# Altium project Servo-Board-v1.0.PrjPcb (part 16 of 19)

## Sheet Motor_Driver_Sheet4.SchDoc
size 420 x 297 mm; SheetNumber: 29; SheetTotal: 32
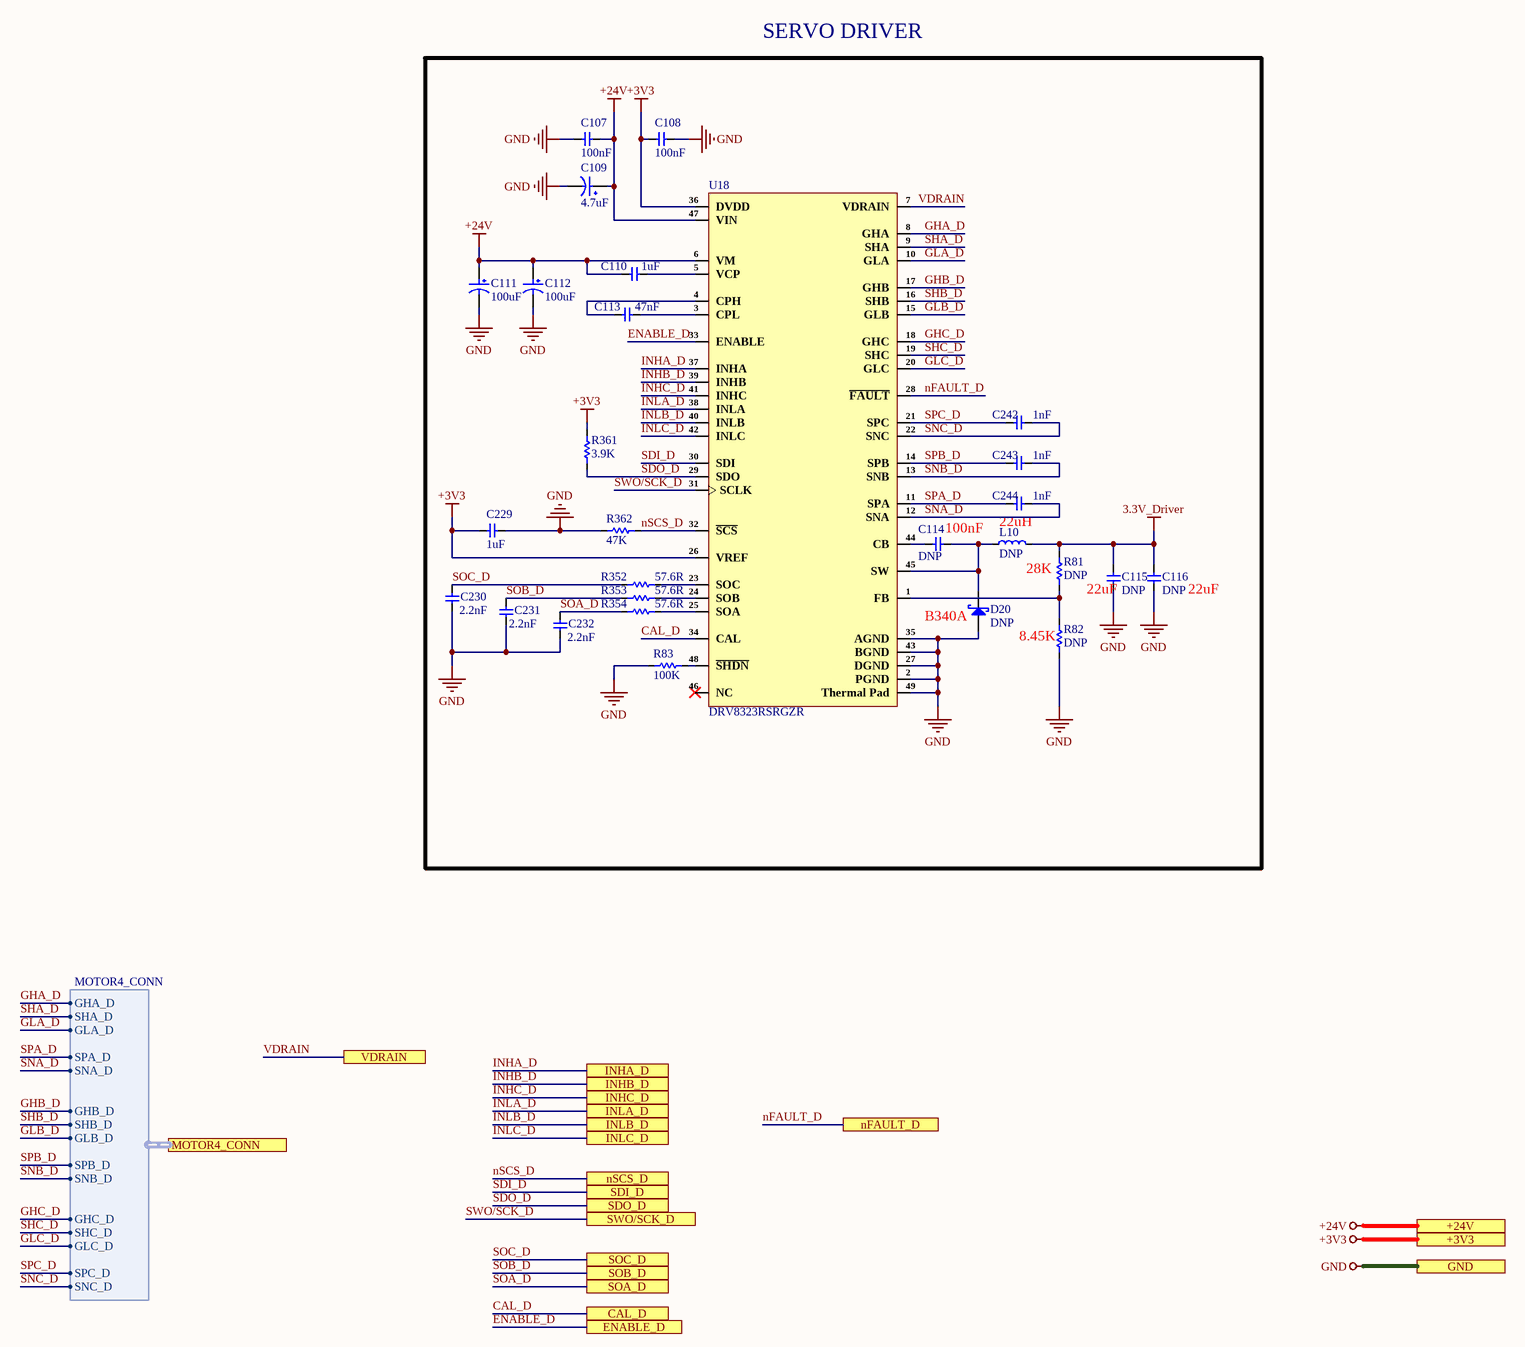
[diagram p28: Motor_Driver_Sheet4.SchDoc]

### Parts
C107  100nF  [cap-0402]
C108  100nF  [cap-0402]
C109  4.7uF  [VT1H4R7M0405]
C110  1uF  [Cap-0402]
C111  100uF  [RVT1A101M0605]
C112  100uF  [RVT1A101M0605]
C113  47nF  [Cap-0402]
C114  DNP  [cap-0402]
C115  DNP  [Cap-0805]
C116  DNP  [Cap-0805]
C229  1uF  [Cap-0402]
C230  2.2nF  [Cap-0603]
C231  2.2nF  [Cap-0603]
C232  2.2nF  [Cap-0603]
C242  1nF  [Cap-0402]
C243  1nF  [Cap-0402]
C244  1nF  [Cap-0402]
D20  DNP  [SMA(DO-214AC)]
L10  DNP  [SLF7045T- 220MR90-PF]
R81  DNP  [Res-0402]
R82  DNP  [Res-0402]
R83  100K  [Res-0402]
R352  57.6R  [Res-0402]
R353  57.6R  [Res-0402]
R354  57.6R  [Res-0402]
R361  3.9K  [Res-0402]
R362  47K  [Res-0402]
U18  DRV8323RSRGZR  [48-VQFN (7x7)]

### Ports
+3V3 (see Servo4[3A], CAN_Sheet[5D], Connector_Sheet[5D], Controller_Sheet[5D], Encoder_Sheet1[5D], Encoder_Sheet2[5D], Encoder_Sheet3[5D], Encoder_Sheet4[5D], EtherCAT_Sheet[5D], Motor_Driver_Sheet1[5D], Motor_Driver_Sheet2[5D], Motor_Driver_Sheet3[5D], Power_Sheet[5D], RJ45_Sheet[5D], RS485_RS232_Sheet[3D], Sec_Controller_Sheet1[5D], Sec_Controller_Sheet2[5D], Sec_Controller_Sheet3[5D], Sec_Controller_Sheet4[5D]), +24V (see Servo4[3A], Connector_Sheet[5D], DIO_1[5D], DIO_2[5D], DIO_3[5D], DIO_4[5D], MOSFET_Driver_Sheet1[5D], MOSFET_Driver_Sheet2[5D], MOSFET_Driver_Sheet3[5D], MOSFET_Driver_Sheet4[5D], Motor_Driver_Sheet1[5D], Motor_Driver_Sheet2[5D], Motor_Driver_Sheet3[5D], Power_Sheet[5D]), CAL_D (see Servo4[3B], Sec_Controller_Sheet4[2D]), ENABLE_D (see Servo4[3B], Sec_Controller_Sheet4[2D]), GND (see Servo4[3B], CAN_Sheet[5D], Connector_Sheet[5D], Controller_Sheet[5D], DIO_1[5D], DIO_2[5D], DIO_3[5D], DIO_4[5D], Encoder_Sheet1[5D], Encoder_Sheet2[5D], Encoder_Sheet3[5D], Encoder_Sheet4[5D], EtherCAT_Sheet[5D], MOSFET_Driver_Sheet1[5D], MOSFET_Driver_Sheet2[5D], MOSFET_Driver_Sheet3[5D], MOSFET_Driver_Sheet4[5D], Motor_Driver_Sheet1[5D], Motor_Driver_Sheet2[5D], Motor_Driver_Sheet3[5D], Power_Sheet[5D], RJ45_Sheet[5D], RS485_RS232_Sheet[3D], Sec_Controller_Sheet1[5D], Sec_Controller_Sheet2[5D], Sec_Controller_Sheet3[5D], Sec_Controller_Sheet4[5D]), INHA_D (see Servo4[3B], Sec_Controller_Sheet4[2D]), INHB_D (see Servo4[3B], Sec_Controller_Sheet4[2D]), INHC_D (see Servo4[3B], Sec_Controller_Sheet4[2D]), INLA_D (see Servo4[3B], Sec_Controller_Sheet4[2D]), INLB_D (see Servo4[3B], Sec_Controller_Sheet4[2D]), INLC_D (see Servo4[3B], Sec_Controller_Sheet4[2D]), MOTOR4_CONN (harness MOTOR4_CONN, see Servo4[4B], MOSFET_Driver_Sheet4[2D]), nFAULT_D (see Servo4[3B], Sec_Controller_Sheet4[3D]), nSCS_D (see Servo4[3B], Sec_Controller_Sheet4[2D]), SDI_D (see Servo4[3B], Sec_Controller_Sheet4[2D]), SDO_D (see Servo4[3B], Sec_Controller_Sheet4[2D]), SOA_D (see Servo4[3B], Sec_Controller_Sheet4[2D]), SOB_D (see Servo4[3B], Sec_Controller_Sheet4[2D]), SOC_D (see Servo4[3B], Sec_Controller_Sheet4[2D]), SWO/SCK_D (see Servo4[3B], Sec_Controller_Sheet4[2D]), VDRAIN (see Servo4[4B], MOSFET_Driver_Sheet1[2D], MOSFET_Driver_Sheet2[2D], MOSFET_Driver_Sheet3[2D], MOSFET_Driver_Sheet4[2D], Motor_Driver_Sheet1[2D], Motor_Driver_Sheet2[2D], Motor_Driver_Sheet3[2D])

### Harnesses
MOTOR4_CONN: GHA_D, SHA_D, GLA_D, SPA_D, SNA_D, GHB_D, SHB_D, GLB_D, SPB_D, SNB_D, GHC_D, SHC_D, GLC_D, SPC_D, SNC_D

### Nets
3.3V_Driver: C115.2 C116.2 L10.2 R81.2
+3V3: C108.2 C229.1 R361.2 U18.26(VREF) U18.36(DVDD) ; port +3V3
GND: C107.2 C108.1 C109.2 C111.2 C112.2 C115.1 C116.1 C229.2 C230.1 C231.1 C232.1 D20.2(A) R82.1 R83.1 R362.1 U18.2(PGND) U18.27(DGND) U18.35(AGND) U18.43(BGND) U18.49(Thermal_Pad) ; port GND
VDRAIN: C107.1 C109.1 C110.2 C111.1 C112.1 U18.6(VM) U18.7(VDRAIN) U18.47(VIN) ; port +24V, port VDRAIN  [also labelled +24V]
CAL_D: U18.34(CAL) ; port CAL_D
ENABLE_D: U18.33(ENABLE) ; port ENABLE_D
GHA_D: U18.8(GHA) ; port MOTOR4_CONN.GHA_D
GHB_D: U18.17(GHB) ; port MOTOR4_CONN.GHB_D
GHC_D: U18.18(GHC) ; port MOTOR4_CONN.GHC_D
GLA_D: U18.10(GLA) ; port MOTOR4_CONN.GLA_D
GLB_D: U18.15(GLB) ; port MOTOR4_CONN.GLB_D
GLC_D: U18.20(GLC) ; port MOTOR4_CONN.GLC_D
INHA_D: U18.37(INHA) ; port INHA_D
INHB_D: U18.39(INHB) ; port INHB_D
INHC_D: U18.41(INHC) ; port INHC_D
INLA_D: U18.38(INLA) ; port INLA_D
INLB_D: U18.40(INLB) ; port INLB_D
INLC_D: U18.42(INLC) ; port INLC_D
nFAULT_D: U18.28(~{FAULT}) ; port nFAULT_D
nSCS_D: R362.2 U18.32(~{SCS}) ; port nSCS_D
SDI_D: U18.30(SDI) ; port SDI_D
SDO_D: R361.1 U18.29(SDO) ; port SDO_D
SHA_D: U18.9(SHA) ; port MOTOR4_CONN.SHA_D
SHB_D: U18.16(SHB) ; port MOTOR4_CONN.SHB_D
SHC_D: U18.19(SHC) ; port MOTOR4_CONN.SHC_D
SNA_D: C244.1 U18.12(SNA) ; port MOTOR4_CONN.SNA_D
SNB_D: C243.1 U18.13(SNB) ; port MOTOR4_CONN.SNB_D
SNC_D: C242.1 U18.22(SNC) ; port MOTOR4_CONN.SNC_D
SOA_D: C232.2 R354.1 ; port SOA_D
SOB_D: C231.2 R353.1 ; port SOB_D
SOC_D: C230.2 R352.1 ; port SOC_D
SPA_D: C244.2 U18.11(SPA) ; port MOTOR4_CONN.SPA_D
SPB_D: C243.2 U18.14(SPB) ; port MOTOR4_CONN.SPB_D
SPC_D: C242.2 U18.21(SPC) ; port MOTOR4_CONN.SPC_D
SWO/SCK_D: U18.31(SCLK) ; port SWO/SCK_D
NetC110_1: C110.1 U18.5(VCP)
NetC113_1: C113.1 U18.4(CPH)
NetC113_2: C113.2 U18.3(CPL)
NetC114_1: C114.1 D20.1(K) L10.1 U18.45(SW)
NetC114_2: C114.2 U18.44(CB)
NetR81_1: R81.1 R82.2 U18.1(FB)
NetR83_2: R83.2 U18.48(~{SHDN})
NetR352_2: R352.2 U18.23(SOC)
NetR353_2: R353.2 U18.24(SOB)
NetR354_2: R354.2 U18.25(SOA)

Not connected (* = marked no-connect by the designer): U18 46(NC)*

### Notes on the sheet
- SERVO DRIVER
- (near C114) 100nF
- 22uH
- B340A
- 28K
- (near C115) 22uF
- (near C116) 22uF
- (near R82) 8.45K
- File:
- Title:
- Date:
- Page
- Num:
- Total:
- Drawn By: Huzaifa Ali

### Library data of the parts
C107 C108 C114 = C1005X7R1H104KT000F: as C59-C62 on sheet Sec_Controller_Sheet3; Supplier 1: Avnet; Manufacturer Part Number: C1005X7R1H104KT000F; RoHS: No; Category: Ceramic Capacitors; Dielectric: X7R; Supplier Part Number 1: C1005X7R1H104KT000F; LCSC Part Number: C361198; ComponentLink1Description: LCSC; ComponentLink1URL: https://www.lcsc.com/product-detail/Multilayer-Ceramic-Capacitors-MLCC-SMD-SMT_TDK-C1005X7R1H104KT000F_C361198.html
C109 = VT1H4R7M0405: 4.7uF 50V 14mA@120Hz ±20% SMD,D4xL5.4mm Aluminum Electrolytic Capacitors - SMD ROHS; Manufacturer: Roqang; Supplier: LCSC; LCSC Part Number: C213488; Manufacturer Part Number: VT1H4R7M0405; RoHS: No; Item Type: Capacitor
C110 C229 = CC0402KRX5R6BB105: as C212 on sheet Sec_Controller_Sheet3; Supplier 1: Mouser; Manufacturer Part Number: CC0402KRX5R6BB105; RoHS: Yes; Category: Ceramic Capacitors; Stock 1: 6711367; Pricing 1: 1=0.11000, 10=0.05500, 50=0.05500, 100=0.03300, 500=0.02700, 1000=0.02200, 2500=0.02100, 10000=0.01800 (USD); Mount: Surface Mount; Case/Package: 0402; Number of Pins: 2; Case Code (Metric): 1005; Case Code (Imperial): 0402; Min Operating Temperature: -55°C; Max Operating Temperature: 85°C; Capacitance: 1uF; Dielectric: X5R; Package Quantity: 1; Voltage Rating: 10V; Packaging: Tape and Reel; Voltage Rating (DC): 10V; Termination: SMD/SMT; Resistor Type: Ceramic; Series: CC; Construction: Flat; Length: 1mm; Width: 0.02inch; Height: 0.5mm; Thickness: 0.022inch; Depth: 0.5mm; Radiation Hardening: No; REACH SVHC: No SVHC; Lead Free: Lead Free; Halogen Free: Halogen Free; RoHS Compliant: Yes; ComponentLink1URL: https://datasheet.ciiva.com/176/upy-gphc-x5r-4v-to-50v-12-176704.pdf?src-supplier=Digi-Key; ComponentLink1Description: https://datasheet.ciiva.com/176/upy-gphc-x5r-4v-to-50v-12-176704.pdf?src-supplier=Digi-Key; ComponentLink2URL: https://datasheet.ciiva.com/176/mlccorderingcode-176705.pdf?src-supplier=Digi-Key; ComponentLink2Description: https://datasheet.ciiva.com/176/mlccorderingcode-176705.pdf?src-supplier=Digi-Key; ComponentLink3URL: https://datasheet.ciiva.com/176/mlccorderingcode-176706.pdf?src-supplier=Digi-Key; ComponentLink3Description: https://datasheet.ciiva.com/176/mlccorderingcode-176706.pdf?src-supplier=Digi-Key; Supplier Part Number 1: 603-CC402KRX5R6BB105; LCSC Part Number: C106254
C111 C112 = RVT1A101M0605: as C136 on sheet MOSFET_Driver_Sheet4; Manufacturer Part Number: RVT1A101M0605; Package: SMD,D6.3xL5.4mm; LCSC Part Number: C72474; Item Type: Capacitor; ComponentLink1Description: LCSC; ComponentLink1URL: https://www.lcsc.com/product-detail/Aluminum-Electrolytic-Capacitors-SMD_ROQANG-RVT1A101M0605_C72474.html
C113 = CC0402KRX7R9BB473: CAP CER 0.047UF 50V X7R 0402; Manufacturer: Yageo; Material: 4241ConductorMaterial; Tolerance: 10%; Temperature Coefficient: 30ppm/°C; Dielectric: 1511DielectricType; Item Type: Capacitor; Supplier: Future Electronics; Supplier Part Number: 2095687; Manufacturer Part Number: CC0402KRX7R9BB473; RoHS: Yes; Category: Ceramic Capacitors; Stock: 1130000; Pricing: 10000=0.0044, 40000=0.0042, 100000=0.004, 150000=0.0041, 250000=0.0039, 400000=0.0037, 500000=0.0038 (USD); Mounting Technology: Surface Mount; Case/Package: 0402; Case Code (Imperial): 0402; Case Code (Metric): 1005; Min Operating Temperature: -55°C; Max Operating Temperature: 125°C; Packaging: Tape and Reel; Value: 47nF; Voltage Rating: 50V; Series: CC; Voltage Rating (DC): 50V; Length: 0.039inch; Width: 0.02inch; Height: 550um; Thickness: 0.022inch; RoHS Compliant: Yes; Halogen Free: 5694HalogenFree; Lead Free: 5697LeadFree; ComponentLink1URL: https://datasheet.octopart.com/CC0402KRX7R9BB473-Yageo-datasheet-166511530.pdf?src-supplier=Future+Electronics; ComponentLink1Description: https://datasheet.octopart.com/CC0402KRX7R9BB473-Yageo-datasheet-166511530.pdf?src-supplier=Future+Electronics; ComponentLink2URL: http://www.yageo.com/documents/recent/UPY-GPHC_X7R_6.3V-to-50V_18.pdf?src-supplier=Digikey; ComponentLink2Description: http://www.yageo.com/documents/recent/UPY-GPHC_X7R_6.3V-to-50V_18.pdf?src-supplier=Digikey; ComponentLink3URL: https://datasheet.octopart.com/CC0402KRX7R9BB473-Yageo-datasheet-140260305.pdf?src-supplier=Newark; ComponentLink3Description: https://datasheet.octopart.com/CC0402KRX7R9BB473-Yageo-datasheet-140260305.pdf?src-supplier=Newark; LCSC Part Number: C272875
C115 C116 = GRM21BR61E226ME44L: CAP CER 22UF 25V X5R 0805; Manufacturer: Murata; Material: Ceramic; Tolerance: 20%; Item Type: Capacitor; Supplier 1: Arrow Electronics; Manufacturer Part Number: GRM21BR61E226ME44L; RoHS: Yes; Category: Ceramic Capacitors; Stock 1: 21193; Pricing 1: 1=0.45930, 10=0.35000, 25=0.33950, 50=0.26910, 100=0.22090, 250=0.21320, 500=0.16760, 1000=0.14640, 3000=0.11710, 6000=0.10550, 15000=0.10450 (USD); Mount: Surface Mount; Case/Package: 0805; Case Code (Metric): 2012; Case Code (Imperial): 0805; Weight: 0.000335oz; Min Operating Temperature: -55°C; Max Operating Temperature: 85°C; Capacitance: 22uF; Voltage Rating: 25V; Packaging: Tape and Reel; Dielectric: X5R; Voltage: 25V; Termination: SMD/SMT; Resistor Type: Ceramic; Voltage Rating (DC): 25V; Package Quantity: 3000; Series: GRM; Construction: Flat; Length: 2mm; Width: 1.25mm; Height: 1.25mm; Thickness: 0.057inch; Depth: 1.25mm; REACH SVHC: No SVHC; Lead Free: Lead Free; RoHS Compliant: Yes; ComponentLink1URL: https://datasheet.ciiva.com/22787/1747471-22787265.pdf?src-supplier=Farnell; ComponentLink1Description: https://datasheet.ciiva.com/22787/1747471-22787265.pdf?src-supplier=Farnell; ComponentLink2URL: https://datasheet.ciiva.com/7719/1747471-7719095.pdf?src-supplier=Element14; ComponentLink2Description: https://datasheet.ciiva.com/7719/1747471-7719095.pdf?src-supplier=Element14; ComponentLink3URL: https://datasheet.ciiva.com/28584/1747471-28584199.pdf?src-supplier=Element14; ComponentLink3Description: https://datasheet.ciiva.com/28584/1747471-28584199.pdf?src-supplier=Element14; Supplier Part Number 1: GRM21BR61E226ME44L; LCSC Part Number: C86816
C230-C232 = CC0603KRX7R9BB222: CAP CER 2200PF 50V X7R 0603; Manufacturer: Yageo; Tolerance: 10%; Insulation Resistance: 10GR; Dissipation Factor: 2.5%; Item Type: Capacitor; Supplier 1: RSComponents; Manufacturer Part Number: CC0603KRX7R9BB222; RoHS: Yes; Category: Ceramic Capacitors; Stock 1: 1; Pricing 1: 4000=0.00500 (USD); Mount: Surface Mount; Case/Package: 0603; Number of Pins: 2; Case Code (Metric): 1608; Case Code (Imperial): 0603; Min Operating Temperature: -55°C; Max Operating Temperature: 125°C; Capacitance: 2.2nF; Dielectric: X7R; Package Quantity: 1; Voltage Rating: 50V; Packaging: Tape and Reel; Voltage Rating (DC): 50V; Termination: SMD/SMT; Resistor Type: Ceramic; Voltage: 50V; Series: CC; Length: 1.6mm; Width: 0.031inch; Height: 0.8mm; Thickness: 0.035inch; Depth: 0.8mm; Radiation Hardening: No; REACH SVHC: No SVHC; Lead Free: Lead Free; Halogen Free: Halogen Free; RoHS Compliant: Yes; ComponentLink1URL: https://datasheet.ciiva.com/23768/1079489-23768004.pdf?src-supplier=Newark; ComponentLink1Description: https://datasheet.ciiva.com/23768/1079489-23768004.pdf?src-supplier=Newark; ComponentLink2URL: https://datasheet.ciiva.com/11788/0900766b8079c870-11788403.pdf?src-supplier=RSComponents; ComponentLink2Description: https://datasheet.ciiva.com/11788/0900766b8079c870-11788403.pdf?src-supplier=RSComponents; ComponentLink3URL: https://datasheet.ciiva.com/26862/getdatasheetpartid-403587-26862854.pdf?src-supplier=Verical; ComponentLink3Description: https://datasheet.ciiva.com/26862/getdatasheetpartid-403587-26862854.pdf?src-supplier=Verical; ComponentLink4URL: https://datasheet.ciiva.com/8033/70765-8033863.pdf?src-supplier=Element14; ComponentLink4Description: https://datasheet.ciiva.com/8033/70765-8033863.pdf?src-supplier=Element14; ComponentLink5URL: https://datasheet.ciiva.com/7978/1489800-7978172.pdf?src-supplier=Element14; ComponentLink5Description: https://datasheet.ciiva.com/7978/1489800-7978172.pdf?src-supplier=Element14; ComponentLink6URL: https://datasheet.ciiva.com/28450/1489800-28450632.pdf?src-supplier=Element14; ComponentLink6Description: https://datasheet.ciiva.com/28450/1489800-28450632.pdf?src-supplier=Element14; ComponentLink7URL: https://datasheet.ciiva.com/155/mlccorderingcode-155921.pdf?src-supplier=Digi-Key; ComponentLink7Description: https://datasheet.ciiva.com/155/mlccorderingcode-155921.pdf?src-supplier=Digi-Key; ComponentLink8URL: https://datasheet.ciiva.com/155/mlccorderingcode-155920.pdf?src-supplier=Digi-Key; ComponentLink8Description: https://datasheet.ciiva.com/155/mlccorderingcode-155920.pdf?src-supplier=Digi-Key; ComponentLink9URL: https://datasheet.ciiva.com/155/mlccorderingcode-155922.pdf?src-supplier=Digi-Key; ComponentLink9Description: https://datasheet.ciiva.com/155/mlccorderingcode-155922.pdf?src-supplier=Digi-Key; ComponentLink10URL: https://datasheet.ciiva.com/8033/1489800-8033864.pdf?src-supplier=Element14; ComponentLink10Description: https://datasheet.ciiva.com/8033/1489800-8033864.pdf?src-supplier=Element14; ComponentLink11URL: https://datasheet.ciiva.com/8033/1489800-8033862.pdf?src-supplier=Element14; ComponentLink11Description: https://datasheet.ciiva.com/8033/1489800-8033862.pdf?src-supplier=Element14; ComponentLink12URL: https://datasheet.ciiva.com/16625/upy-gphc-x7r-6-3v-to-50v-8-16625531.pdf?src-supplier=Avnet+Europe; ComponentLink12Description: https://datasheet.ciiva.com/16625/upy-gphc-x7r-6-3v-to-50v-8-16625531.pdf?src-supplier=Avnet+Europe; Supplier Part Number 1: 6169509; LCSC Part Number: C107082
C242-C244 = C1005C0G1E102JT000F: CAP CER 1000PF 25V C0G 0402; Manufacturer: TDK; Item Type: Capacitor; ComponentLink1Description: LCSC; ComponentLink1URL: https://www.lcsc.com/product-detail/Multilayer-Ceramic-Capacitors-MLCC-SMD-SMT_TDK-C1005C0G1E102JT000F_C343059.html; Manufacturer Part Number: C1005C0G1E102JT000F; Package: 0402; LCSC Part Number: C343059
D20 = B340A: 40V 3A 550mV@3A SMA(DO-214AC) Schottky Barrier Diodes (SBD) ROHS; Manufacturer: FUXINSEMI; Item Type: Diode; Manufacturer Part Number: B340A; Package: SMA(DO-214AC); LCSC Part Number: C3018525; ComponentLink1Description: LCSC; ComponentLink1URL: https://www.lcsc.com/product-detail/Schottky-Barrier-Diodes-SBD_FUXINSEMI-B340A_C3018525.html
L10 = SLF7045T-220MR90-PF: FIXED IND 22UH 1.34A 73.2MOHM SM; Manufacturer: TDK; Core Material: Ferrite; Tolerance: 20%; Saturation Current: 900mA; Shielding: Shielded; DC Resistance (DCR): 61mR; Test Frequency: 100kHz; Item Type: Inductor; Supplier 1: RSComponents; Manufacturer Part Number: SLF7045T-220MR90-PF; RoHS: Yes; Category: Fixed Inductors; Stock 1: 650; Pricing 1: 10=0.64900, 100=0.61900, 500=0.49700, 1000=0.34500, 2500=0.32500 (GBP); Mount: Surface Mount; Case/Package: Nonstandard; Min Operating Temperature: -40°C; Max Operating Temperature: 85°C; Packaging: Tape and Reel; Inductance Tolerance: 20%; Package Quantity: 1; Current Rating: 1.34A; Resistor Type: Wirewound; Inductance: 22uH; Max DC Current: 900mA; Termination: SMD/SMT; RMS Current (Irms): 1.34A; DC Current: 1.34A; Series: SLF; Rated Current-Max: 900mA; Length: 0.276inch; Width: 0.276inch; Height: 4.5mm; Height - Seated (Max): 0.189inch; Depth: 7.2mm; Radiation Hardening: No; Reach SVHC Compliant: Yes; Military Standard: Not; Lead Free: Lead Free; RoHS Compliant: Yes; ComponentLink1URL: https://datasheet.ciiva.com/3866/84print-detail-pdf-phplangenpart-noslf7045t-220mr90-pfnreimp-unit-x-3866590.pdf?src-supplier=Arrow+Electronics; ComponentLink1Description: https://datasheet.ciiva.com/3866/84print-detail-pdf-phplangenpart-noslf7045t-220mr90-pfnreimp-unit-x-3866590.pdf?src-supplier=Arrow+Electronics; LCSC Part Number: C13754; Supplier Part Number 1: 9164248
R81 = RT0402BRD0728KL: RES SMD 28K OHM 0.1% 1/16W 0402; Manufacturer: Yageo; Item Type: Resistor; Supplier: Digi-Key; Supplier Part Number: YAG4224CT-ND; Manufacturer Part Number: RT0402BRD0728KL; RoHS: Yes; Category: Chip SMD Resistors; Stock: 21647; Pricing: 1=0.38, 10=0.307, 50=0.1704, 100=0.1198, 500=0.07636, 1000=0.05287, 5000=0.04406 (USD); ComponentLink1URL: https://datasheet.ciiva.com/2582/pyu-rt-1-to-0-05-rohs-l-5-2582274.pdf?src-supplier=Digi-Key; ComponentLink1Description: https://datasheet.ciiva.com/2582/pyu-rt-1-to-0-05-rohs-l-5-2582274.pdf?src-supplier=Digi-Key; LCSC Part Number: C852686
R82 = 0402WGF8451TCE: 62.5mW Thick Film Resistors 50V ±100ppm/℃ ±1% 8.45kΩ 0402 Chip Resistor - Surface Mount ROHS; Manufacturer: Royal Electronic Factory; Supplier: Mouser; LCSC Part Number: C270579; Manufacturer Part Number: 0402WGF8451TCE; RoHS: No; Item Type: Resistor; Pricing: 10000=0.004 (USD)
R83 = RT0402BRD07100KL: RES SMD 100K OHM 0.1% 1/16W 0402; Manufacturer: Yageo; Voltage Rating (DC): 50V; Item Type: Resistor; Supplier: Digikey; Supplier Part Number: YAG1343CT-ND; Manufacturer Part Number: RT0402BRD07100KL; RoHS: Yes; Category: Chip SMD Resistors; Stock: 62932; Pricing: 1=0.16, 10=0.121, 50=0.0958, 100=0.0859, 500=0.0654, 1000=0.0578, 5000=0.04283 (USD); ComponentLink1URL: https://datasheet.ciiva.com/12724/pyu-rt-1-to-0-05-rohs-l-4-12724954.pdf?src-supplier=Mouser; ComponentLink1Description: https://datasheet.ciiva.com/12724/pyu-rt-1-to-0-05-rohs-l-4-12724954.pdf?src-supplier=Mouser; LCSC Part Number: C852472
R352-R354 = ERJ-2RKF57R6X: RES SMD 57.6 OHM 1% 1/10W 0402; Manufacturer: Panasonic; Item Type: Resistors; Supplier: Mouser; Supplier Part Number: 667-ERJ-2RKF57R6X; Manufacturer Part Number: ERJ-2RKF57R6X; RoHS: Yes; Stock: 32931; Pricing: 1=0.1, 10=0.015, 50=0.015, 100=0.009, 1000=0.006, 10000=0.003 (USD); ComponentLink1URL: https://datasheet.ciiva.com/9188/aoa0000ce2-9188571.pdf?src-supplier=Avnet; ComponentLink1Description: https://datasheet.ciiva.com/9188/aoa0000ce2-9188571.pdf?src-supplier=Avnet; ComponentLink2URL: https://datasheet.ciiva.com/9188/aoa0000ce2-9188574.pdf?src-supplier=Avnet; ComponentLink2Description: https://datasheet.ciiva.com/9188/aoa0000ce2-9188574.pdf?src-supplier=Avnet; ComponentLink3URL: https://datasheet.ciiva.com/24026/aoa0000ce2-24026248.pdf?src-supplier=Mouser; ComponentLink3Description: https://datasheet.ciiva.com/24026/aoa0000ce2-24026248.pdf?src-supplier=Mouser; ComponentLink4URL: https://datasheet.ciiva.com/43467/1678782-43467198.pdf?src-supplier=Farnell; ComponentLink4Description: https://datasheet.ciiva.com/43467/1678782-43467198.pdf?src-supplier=Farnell; ComponentLink5URL: https://datasheet.ciiva.com/46372/1678782-46372935.pdf?src-supplier=Element14; ComponentLink5Description: https://datasheet.ciiva.com/46372/1678782-46372935.pdf?src-supplier=Element14; ComponentLink6URL: https://datasheet.ciiva.com/46372/1678782-46372936.pdf?src-supplier=Element14; ComponentLink6Description: https://datasheet.ciiva.com/46372/1678782-46372936.pdf?src-supplier=Element14; ComponentLink7URL: https://datasheet.ciiva.com/22668/1678782-22668391.pdf?src-supplier=Element14; ComponentLink7Description: https://datasheet.ciiva.com/22668/1678782-22668391.pdf?src-supplier=Element14; ComponentLink8URL: https://datasheet.ciiva.com/22743/1678782-22743894.pdf?src-supplier=Element14; ComponentLink8Description: https://datasheet.ciiva.com/22743/1678782-22743894.pdf?src-supplier=Element14; ComponentLink9URL: https://datasheet.ciiva.com/30107/aoa0000ce2-30107676.pdf?src-supplier=Onlinecomponents.com; ComponentLink9Description: https://datasheet.ciiva.com/30107/aoa0000ce2-30107676.pdf?src-supplier=Onlinecomponents.com; LCSC Part Number: C3025671
R361 = RC0402FR-073K9L: RES 3.9K OHM 1% 1/16W 0402; Manufacturer: Yageo; Temperature Coefficient: 100ppm/°C; Power Rating: 62.5mW; Value: 3.9kR; Voltage Rating: 50V; Max Power Dissipation: 63mW; Item Type: Resistor; Supplier: Future Electronics; Supplier Part Number: 9808155; Manufacturer Part Number: RC0402FR-073K9L; RoHS: Yes; Category: Chip SMD Resistors; Stock: 6910000; Pricing: 10000=0.0011, 100000=0.0011, 300000=0.001, 750000=0.001, 2000000=0.0009 (USD); Case/Package: 0402; Case Code (Imperial): 0402; Case Code (Metric): 1005; Min Operating Temperature: -55°C; Max Operating Temperature: 155°C; Tolerance: 1%; Packaging: Tape and Reel; Resistor Type: Thick Film; Series: RC; Termination: SMD/SMT; Number of Terminations: 2; Features: Moisture Resistant; Resistance Tolerance: 1%; Construction: Rectangular; Voltage Rating (AC): 50V; Length: 1mm; Depth: 0.5mm; Lead Free: Lead Free; RoHS Compliant: Yes; Reach SVHC Compliant: Unknown; Military Standard: Not; ComponentLink1URL: https://datasheet.ciiva.com/12666/pyu-rc0402-51-rohs-l-6-r-12666997.pdf?src-supplier=Mouser; ComponentLink1Description: https://datasheet.ciiva.com/12666/pyu-rc0402-51-rohs-l-6-r-12666997.pdf?src-supplier=Mouser; ComponentLink2URL: https://datasheet.ciiva.com/7849/1018594-7849989.pdf?src-supplier=Element14; ComponentLink2Description: https://datasheet.ciiva.com/7849/1018594-7849989.pdf?src-supplier=Element14; ComponentLink3URL: https://datasheet.ciiva.com/7849/1018594-7849990.pdf?src-supplier=Element14; ComponentLink3Description: https://datasheet.ciiva.com/7849/1018594-7849990.pdf?src-supplier=Element14; ComponentLink4URL: https://datasheet.ciiva.com/15189/getdatasheetpartid-469246-15189453.pdf?src-supplier=Verical; ComponentLink4Description: https://datasheet.ciiva.com/15189/getdatasheetpartid-469246-15189453.pdf?src-supplier=Verical; LCSC Part Number: C131467
R362 = RC0402FR-0747KL: RES 47K OHM 1% 1/16W 0402; Manufacturer: Yageo; Power Rating: 62.5mW; Temperature Coefficient: 100ppm/°C; Voltage Rating: 50V; Resistance: 47kR; Max Power Dissipation: 63mW; Item Type: Resistor; Supplier 1: Avnet; Manufacturer Part Number: RC0402FR-0747KL; RoHS: Yes; Category: Chip SMD Resistors; Stock 1: 680000; Pricing 1: 10000=0.00085, 20000=0.00087, 40000=0.00084, 60000=0.00083, 80000=0.00079, 100000=0.00078, 1000000=0.00076 (USD); Case/Package: 0402; Case Code (Imperial): 0402; Case Code (Metric): 1005; Size Code: 0402; Min Operating Temperature: -55°C; Max Operating Temperature: 155°C; Tolerance: 1%; Series: RC; Packaging: Tape and Reel; Package Quantity: 1; Termination: SMD/SMT; Resistor Type: Thick Film; Number of Terminations: 2; Features: Moisture Resistant; Resistance Tolerance: 1%; Construction: Rectangular; Length: 1mm; Width: 0.02inch; Height: 0.016inch; Depth: 0.5mm; RoHS Compliant: Yes; Military Standard: Not; Lead Free: Lead Free; ComponentLink1URL: https://datasheet.ciiva.com/46412/1018594-46412839.pdf?src-supplier=Element14; ComponentLink1Description: https://datasheet.ciiva.com/46412/1018594-46412839.pdf?src-supplier=Element14; ComponentLink2URL: https://datasheet.ciiva.com/2453/pyu-r-int-thick-7-2453389.pdf?src-supplier=Digi-Key; ComponentLink2Description: https://datasheet.ciiva.com/2453/pyu-r-int-thick-7-2453389.pdf?src-supplier=Digi-Key; ComponentLink3URL: https://datasheet.ciiva.com/2453/pyu-r-int-thick-7-2453390.pdf?src-supplier=Digi-Key; ComponentLink3Description: https://datasheet.ciiva.com/2453/pyu-r-int-thick-7-2453390.pdf?src-supplier=Digi-Key; ComponentLink4URL: https://datasheet.ciiva.com/2453/pyu-r-int-thick-7-2453388.pdf?src-supplier=Digi-Key; ComponentLink4Description: https://datasheet.ciiva.com/2453/pyu-r-int-thick-7-2453388.pdf?src-supplier=Digi-Key; ComponentLink5URL: https://datasheet.ciiva.com/15189/getdatasheetpartid-323748-15189466.pdf?src-supplier=Verical; ComponentLink5Description: https://datasheet.ciiva.com/15189/getdatasheetpartid-323748-15189466.pdf?src-supplier=Verical; ComponentLink6URL: https://datasheet.ciiva.com/16793/pyu-rc0402-51-rohs-l-6-r-16793430.pdf?src-supplier=Future+Electronics; ComponentLink6Description: https://datasheet.ciiva.com/16793/pyu-rc0402-51-rohs-l-6-r-16793430.pdf?src-supplier=Future+Electronics; Supplier Part Number 1: RC0402FR-0747KL; LCSC Part Number: C93943
U18 = DRV8323RSRGZR: IC MTR DRV MULTIPHAS 6-60V 48QFN; Manufacturer: Texas Instruments; Supplier: Digikey; Supplier Part Number: 296-47769-1-ND; Manufacturer Part Number: DRV8323RSRGZR; RoHS: Yes; Item Type: IC; Stock: 39326; Pricing: 1=5.19, 10=4.659, 25=4.404, 100=3.8169, 250=3.62116, 500=3.24926, 1000=2.74033 (USD); ComponentLink1URL: http://www.ti.com/general/docs/suppproductinfo.tsp?distId=10&amp;gotoUrl=http%3A%2F%2Fwww.ti.com%2Flit%2Fgpn%2Fdrv8323r&src-supplier=Digikey; ComponentLink1Description: http://www.ti.com/general/docs/suppproductinfo.tsp?distId=10&amp;gotoUrl=http%3A%2F%2Fwww.ti.com%2Flit%2Fgpn%2Fdrv8323r&src-supplier=Digikey; ComponentLink2URL: http://www.ti.com/lit/ds/symlink/drv8323r.pdf?src-supplier=Digikey; ComponentLink2Description: http://www.ti.com/lit/ds/symlink/drv8323r.pdf?src-supplier=Digikey